# Altium project BUCK_48V-12V.PrjPcb
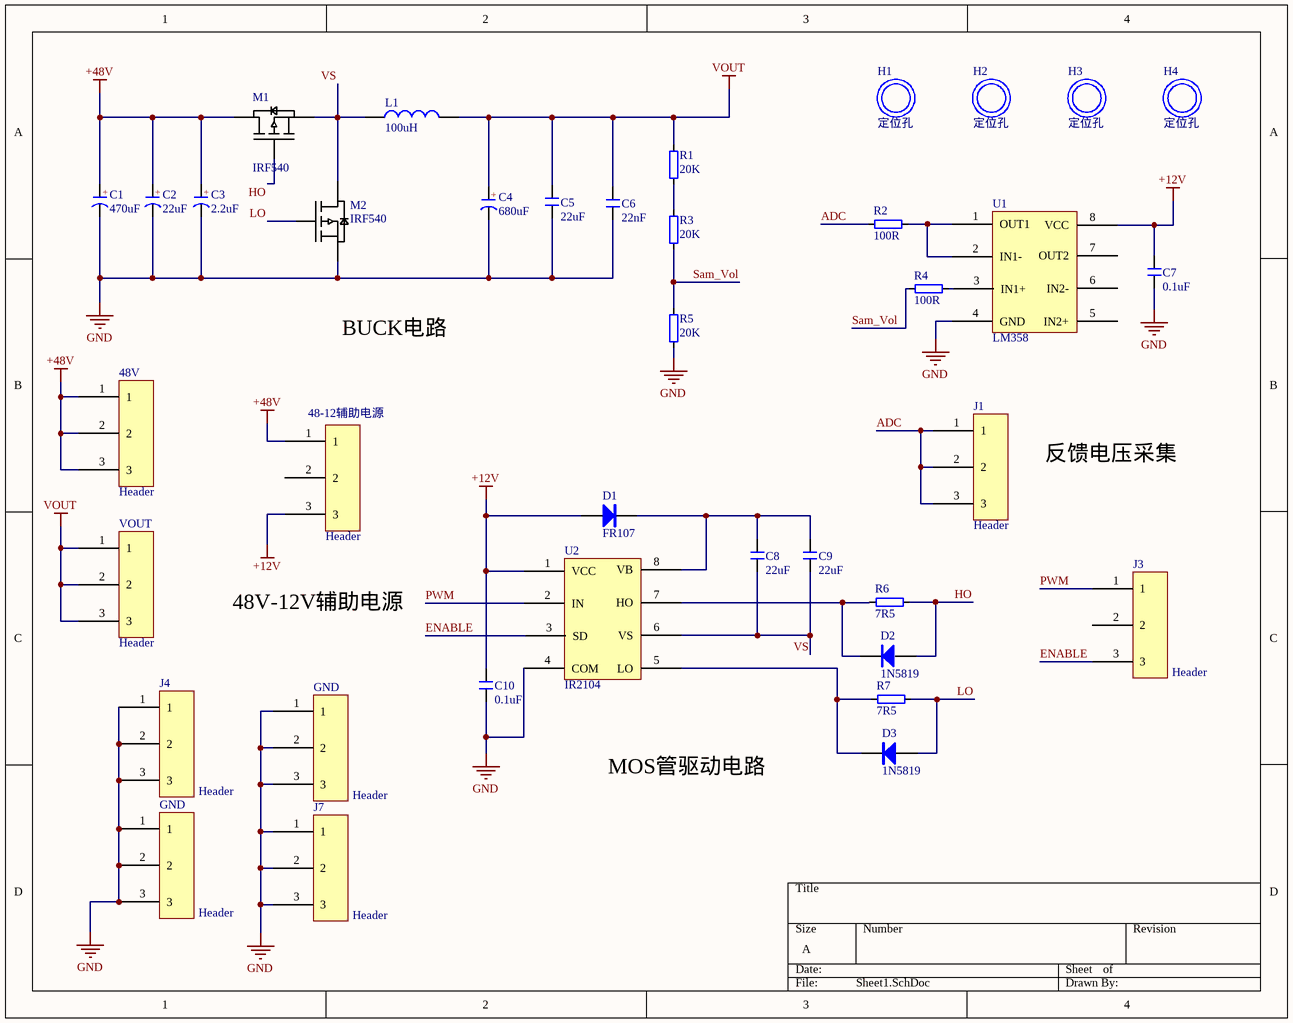
[diagram p0: Sheet1.SchDoc]
1 sheet, 38 parts. Net scope: global (net labels, ports and power ports of the same name join across sheets).
Board file: BUCK电路.PcbDoc

## Sheet Sheet1.SchDoc
size A

### Parts
(Parts that share a designator on the sheet are numbered #1, #2 ... from top to bottom, then left to right.)
48-12辅助电源  Header  [KF128-3.81-3P]
48V  Header  [HDR2.54-LI-3P]
C1  470uF  [CAP 16*25]
C2  22uF  [CAP 8*10.5]
C3  2.2uF  [CAP 6.3*5.4]
C4  680uF  [CAP 10*16]
C5  22uF  [C 1206]
C6  22nF  [C 0603]
C7  0.1uF  [C 0603]
C8  22uF  [C 1206]
C9  22uF  [C 1206]
C10  0.1uF  [C 0603]
D1  FR107  [SOD-123]
D2  1N5819  [SOD-123]
D3  1N5819  [SOD-123]
GND#1  Header  [HDR2.54-LI-3P]
GND#2  Header  [KF128-3.81-3P]
H1  定位孔  [M3x10_L]
H2  定位孔  [M3x10_L]
H3  定位孔  [M3x10_L]
H4  定位孔  [M3x10_L]
J1  Header  [KF128-3.81-3P]
J3  Header  [HDR2.54-LI-3P]
J4  Header  [HDR2.54-LI-3P]
J7  Header  [HDR2.54-LI-3P]
L1  100uH  [L-65125]
M1  IRF540  [TO220A]
M2  IRF540  [TO220A]
R1  20K  [R 1206_M]
R2  100R  [R 0603]
R3  20K  [R 1206_M]
R4  100R  [R 0603]
R5  20K  [R 1206_M]
R6  7R5  [R 0603]
R7  7R5  [R 0603]
U1  LM358  [SOP8_M]
U2  IR2104  [SOIC-8]
VOUT  Header  [HDR2.54-LI-3P]

### Nets
+12V: 48-12辅助电源.3 C7.2 C10.2 D1.1(A) U1.8(VCC) U2.1(VCC)
+48V: 48-12辅助电源.1 48V.1 48V.2 48V.3 C1.1(A) C2.1(A) C3.1(A) M1.2(D)
GND: C1.2(K) C2.2(K) C3.2(K) C4.2(K) C5.1 C6.1 C7.1 C10.1 GND#1.1 GND#1.2 GND#1.3 GND#2.1 GND#2.2 GND#2.3 J4.1 J4.2 J4.3 J7.1 J7.2 J7.3 M2.3(S) R5.1 U1.4(GND) U2.4(COM)
VOUT: C4.1(A) C5.2 C6.2 L1.2 R1.2 VOUT.1 VOUT.2 VOUT.3
ADC: J1.1 J1.2 J1.3 R2.2
ENABLE: J3.3 U2.3(SD)
HO: D2.1(A) M1.1(G) R6.1
LO: D3.1(A) M2.1(G) R7.1
PWM: J3.1 U2.2(IN)
Sam_Vol: R3.1 R4.2 R5.2
VS: C8.1 C9.1 L1.1 M1.3(S) M2.2(D) U2.6(VS)
NetC8_2: C8.2 C9.2 D1.2(K) U2.8(VB)
NetD2_2: D2.2(K) R6.2 U2.7(HO)
NetD3_2: D3.2(K) R7.2 U2.5(LO)
NetR1_1: R1.1 R3.2
NetR2_1: R2.1 U1.1(OUT1) U1.2(IN1-)
NetR4_1: R4.1 U1.3(IN1+)

Not connected (* = marked no-connect by the designer): 48-12辅助电源 2; J3 2; U1 5(IN2+) 6(IN2-) 7(OUT2)

### Notes on the sheet
- BUCK电路
- 反馈电压采集
- 48V-12V辅助电源
- MOS管驱动电路
- (in symbol 电解电容) +

### Library data of the parts
C1-C4 = 电解电容
C5-C10 = 电容
L1 = 电感
R1-R7 = 电阻